# Altium schematic sheet 7SEG_ClockLed.SchDoc
size A4; SheetNumber: 2; SheetTotal: 8
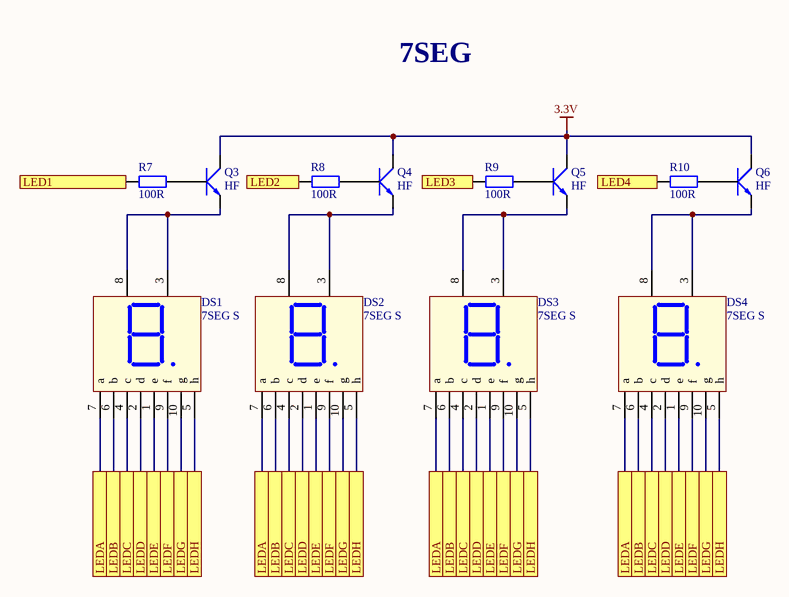
[diagram p0: 7SEG_ClockLed.SchDoc]

## Parts
DS1  7SEG S  [7SEGS]
DS2  7SEG S  [7SEGS]
DS3  7SEG S  [7SEGS]
DS4  7SEG S  [7SEGS]
Q3  HF  [SOT23]
Q4  HF  [SOT23]
Q5  HF  [SOT23]
Q6  HF  [SOT23]
R7  100R  [tro smd 0805]
R8  100R  [tro smd 0805]
R9  100R  [tro smd 0805]
R10  100R  [tro smd 0805]

## Ports
LED1, LED2, LED3, LED4, LEDA, LEDB, LEDC, LEDD, LEDE, LEDF, LEDG, LEDH

## Nets
3.3V: Q3.3(C) Q4.3(C) Q5.3(C) Q6.3(C)
LED1: R7.1 ; port LED1
LED2: R8.1 ; port LED2
LED3: R9.1 ; port LED3
LED4: R10.1 ; port LED4
LEDA: DS1.7(a) DS2.7(a) DS3.7(a) DS4.7(a) ; port LEDA
LEDB: DS1.6(b) DS2.6(b) DS3.6(b) DS4.6(b) ; port LEDB
LEDC: DS1.4(c) DS2.4(c) DS3.4(c) DS4.4(c) ; port LEDC
LEDD: DS1.2(d) DS2.2(d) DS3.2(d) DS4.2(d) ; port LEDD
LEDE: DS1.1(e) DS2.1(e) DS3.1(e) DS4.1(e) ; port LEDE
LEDF: DS1.9(f) DS2.9(f) DS3.9(f) DS4.9(f) ; port LEDF
LEDG: DS1.10(g) DS2.10(g) DS3.10(g) DS4.10(g) ; port LEDG
LEDH: DS1.5(h) DS2.5(h) DS3.5(h) DS4.5(h) ; port LEDH
NetDS1_3: DS1.3(Vcc) DS1.8(Vcc) Q3.2(E)
NetDS2_3: DS2.3(Vcc) DS2.8(Vcc) Q4.2(E)
NetDS3_3: DS3.3(Vcc) DS3.8(Vcc) Q5.2(E)
NetDS4_3: DS4.3(Vcc) DS4.8(Vcc) Q6.2(E)
NetQ3_1: Q3.1(B) R7.2
NetQ4_1: Q4.1(B) R8.2
NetQ5_1: Q5.1(B) R9.2
NetQ6_1: Q6.1(B) R10.2

## Notes on the sheet
- 7SEG

## Library data of the parts
DS1-DS4 = LED7S: Single 7 Seg Dipslay; Value: LED 7S SEG
Q3-Q6 = C1815 HF SMD: NPN transistor; Value: C9014
R7-R10 = Tro 0805 5% 100R: Dán; Don_Vi: Con; So_Chan: 2; Ten_Linh_Kien: Trở 0805 5% 100R; Ma_Hang: MH005251; Chung_Loai: Dán; Kieu_Chan: *